# Altium schematic sheet ADC_AD7689.SchDoc: ADC AD7689
size A4; SheetNumber: 2; SheetTotal: 3
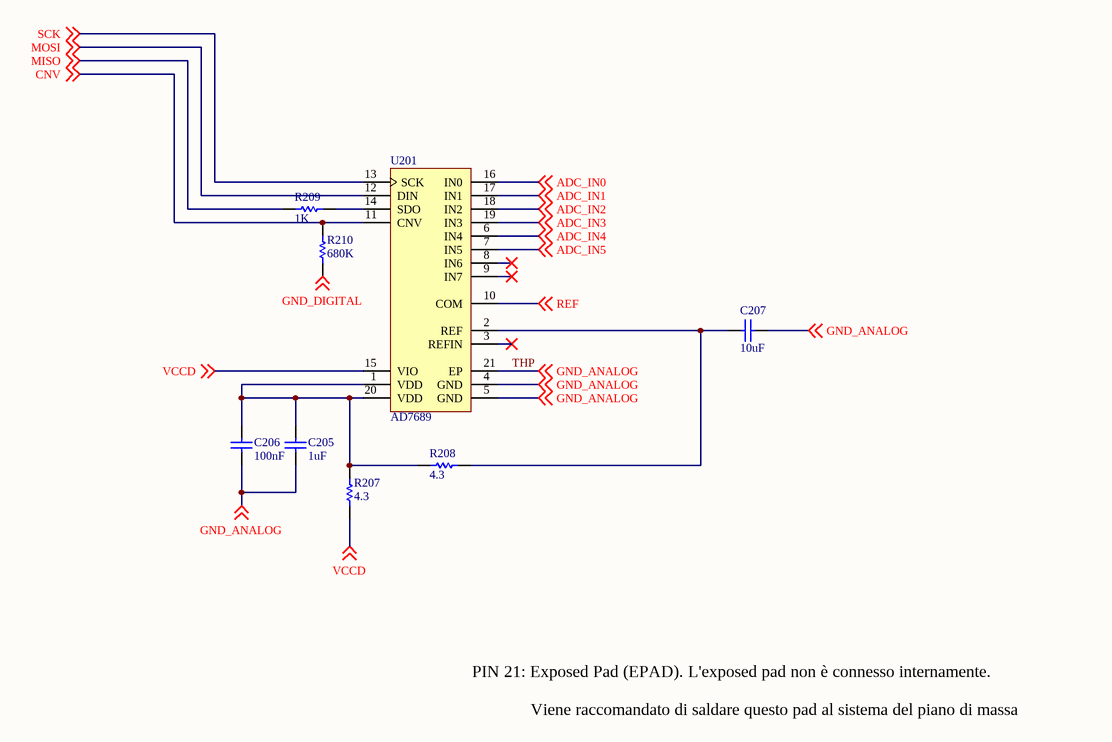
[diagram p0: ADC_AD7689.SchDoc]

## Parts
C205  1uF  [0603 CAPACITOR]
C206  100nF  [0402 Capacitor]
C207  10uF  [0603 CAPACITOR]
R207  4.3  [0402 resistor]
R208  4.3  [0402 resistor]
R209  1K  [0402 resistor]
R210  680K  [0402 resistor]
U201  AD7689  [AD7689]

## Nets
ADC_IN0: U201.16(IN0) ; off-sheet ADC_IN0
ADC_IN1: U201.17(IN1) ; off-sheet ADC_IN1
ADC_IN2: U201.18(IN2) ; off-sheet ADC_IN2
ADC_IN3: U201.19(IN3) ; off-sheet ADC_IN3
ADC_IN4: U201.6(IN4) ; off-sheet ADC_IN4
ADC_IN5: U201.7(IN5) ; off-sheet ADC_IN5
CNV: R210.2 U201.11(CNV) ; off-sheet CNV
GND_DIGITAL: R210.1 ; off-sheet GND_DIGITAL
MISO: R209.1 ; off-sheet MISO
MOSI: U201.12(DIN) ; off-sheet MOSI
REF: U201.10(COM) ; off-sheet REF
SCK: U201.13(SCK) ; off-sheet SCK
THP: C205.1 C206.1 C207.2 U201.4(GND) U201.5(GND) U201.21(EP) ; off-sheet GND_ANALOG  [also labelled GND_ANALOG]
VCCD: R207.1 U201.15(VIO) ; off-sheet VCCD
NetC205_2: C205.2 C206.2 R207.2 R208.1 U201.1(VDD) U201.20(VDD)
NetC207_1: C207.1 R208.2 U201.2(REF)
NetR209_2: R209.2 U201.14(SDO)

Not connected (* = marked no-connect by the designer): U201 3(REFIN)* 8(IN6)* 9(IN7)*

## Notes on the sheet
- PIN 21: Exposed Pad (EPAD). L'exposed pad non è connesso internamente.
  Viene raccomandato di saldare questo pad al sistema del piano di massa
- Title
- Size:
- Date:
- A4
- Number:
- Time:
- Revision:
- Sheet
- of
- File:

## Library data of the parts
C205-C207 = Cap SMD: Capacitor SMD 0402; Manufacturer: MULTICOMP; Manufacturer Part Number: MC0402X104M160CT; Code_IEC: 1005; Published: 8-Jun-2000; LatestRevisionDate: 29-May-2009; LatestRevisionNote: IPC-7351 Footprint Added.; PackageReference: 0402-A; Publisher: Altium Limited; PackageDescription: Chip Inductor; Code_JEITA: 0402; Supplier 1: Farnell; RoHS: YES; Stock 1: 436; Pricing 1: 1=0,003, 10=0,003, 100=0,003, 500=0,002, 1000=0,002 (EUR); ComponentLink1URL: http://www.newark.com/pdfs/datasheets/spc/Ta-1103.pdf; ComponentLink1Description: http://www.newark.com/pdfs/datasheets/spc/Ta-1103.pdf; Supplier Part Number 1: 1709894
  C205: Value: 1uF
  C206: Value: 100nF
  C207: Value: 10uF
R207-R210 = RSMD: Resistor SMD 0402; Manufacturer: MULTICOMP; Manufacturer Part Number: MC00625W040212K; Gamma Prodotti: MULTICOMP - MC Series; Livello di Potenza: 62.5; Tolleranza Resistenza: ± 1%; Modello Case Resistore: 0402 [1005 Metric]; Materiale Elemento Resistivo: Film Spesso; Coefficiente di Temperatura: ± 100; Tensione Nominale: 50; Imballaggio: Nastro; Sostanze Estremamente Preoccupanti (SVHC): No SVHC (16-Jun-2014); Coefficiente di Temperatura +: 100; Intervallo Temperatura di Esercizio: da -55°C a +155; Larghezza Esterna: 1; Lunghezza/Altezza Esterna: 0.35; No. di Pin: 2; Profondità Esterna: 0.5; Serie: MC; Temperatura di Esercizio Max: 155; Temperatura di Esercizio Min: -55; Tolleranza +: 1%; Supplier 1: Farnell; RoHS: Y-EX; Stock 1: 19850; Pricing 1: 50=0,02, 250=0,019, 1000=0,016, 5000=0,012, 15000=0,011 (EUR); Livello di Sensibilità all'Umidità (MSL): -; Coefficiente di Temperatura -: 100; Montaggio Resistore: SMD; Tensione Nominale V DC: 50; Tolleranza -: 1; ComponentLink1URL: http://www.farnell.com/datasheets/1729045.pdf; ComponentLink1Description: http://www.farnell.com/datasheets/1729045.pdf; ComponentLink2URL: http://www.farnell.com/cad/1558901.zip; ComponentLink2Description: http://www.farnell.com/cad/1558901.zip; Supplier Part Number 1: 1358050
  R207 R208: Resistenza: 4.3
  R209: Resistenza: 1K
  R210: Resistenza: 680K
U201 = AD7689: AD7689 PulSAR ADC 250kSPS 16bit 8 channel